# Altium project STANDBY_POWER_SUPPLY_20-100V(Relay).PrjPCB
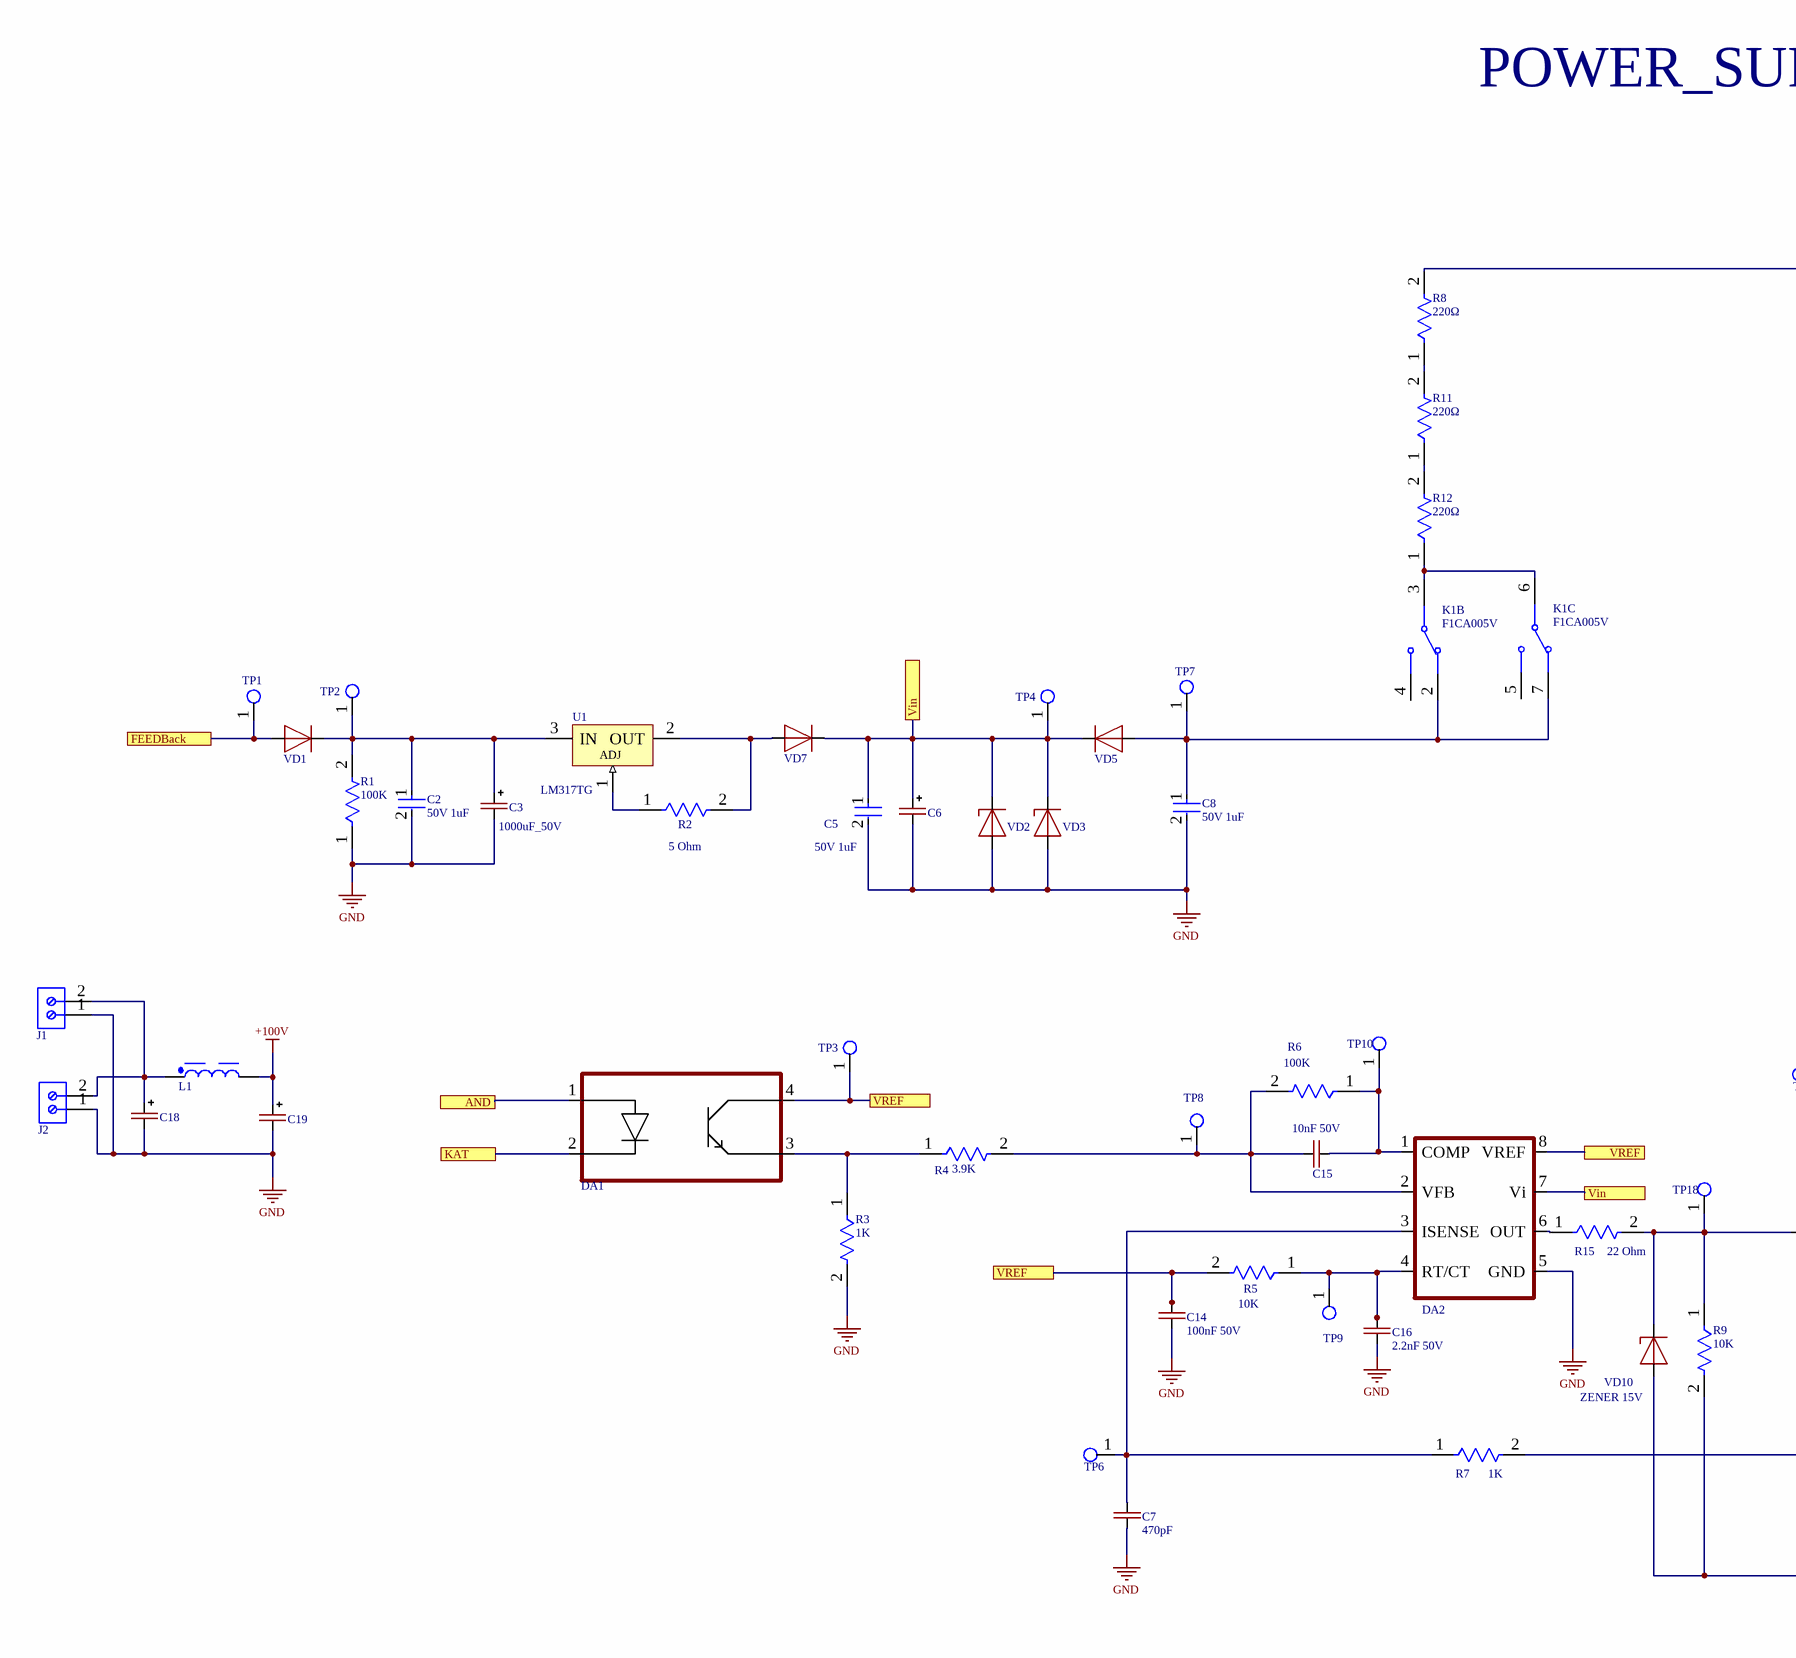
[diagram p0: POWER_SUPPLY_20-100V(Relay).SchDoc, left]
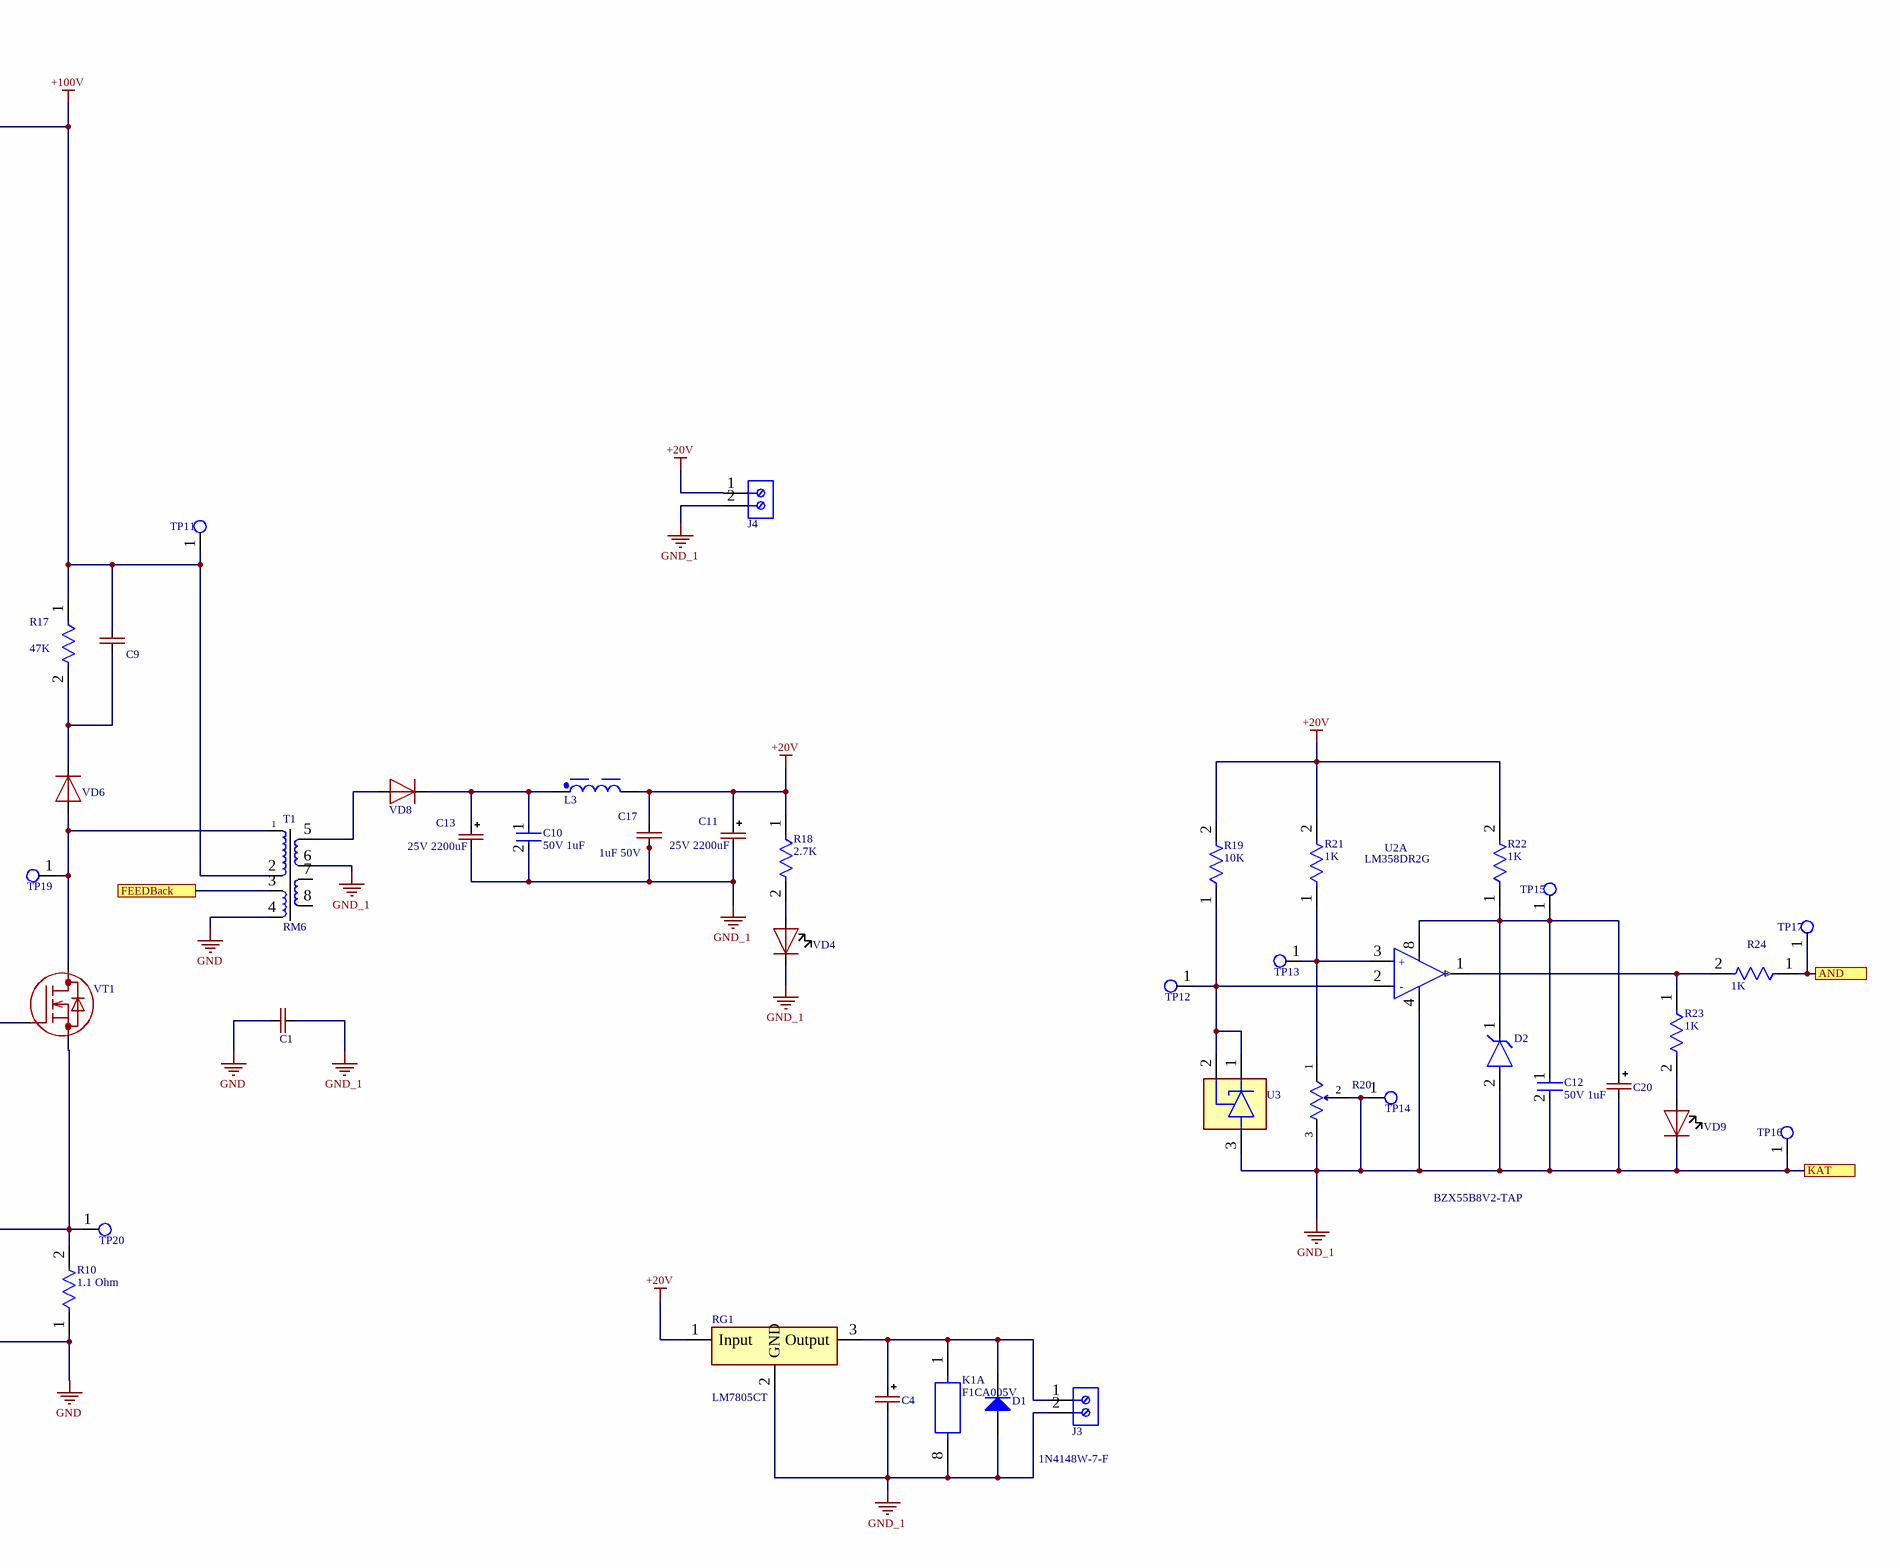
[diagram p1: POWER_SUPPLY_20-100V(Relay).SchDoc, right]
1 sheet, 87 parts. Net scope: flat (ports and power ports of the same name join across sheets).
Board file: POWER_SUPPLY_20-100V(Relay).PcbDoc

## Sheet POWER_SUPPLY_20-100V(Relay).SchDoc
size A1

### Parts
C1  CAP-NON-POLAR  [CAP-V5]  (value not drawn)
C2  50V 1uF  [FP-C0805C-DN-IPC_A]
C3  1000uF_50V  [CAPPOL-12x25]
C4  CAP-POLAR  [CAP-TAN-D]  (value not drawn)
C5  50V 1uF  [FP-C0805C-DN-IPC_A]
C6  CAP-POLAR  [CAPPOL-12x25]  (value not drawn)
C7  470pF  [CAP-0805]
C8  50V 1uF  [FP-C0805C-DN-IPC_A]
C9  CAP-NON-POLAR  [CAP-V5]  (value not drawn)
C10  50V 1uF  [FP-C0805C-DN-IPC_A]
C11  25V 2200uF  [CAPPOL-12x25]
C12  50V 1uF  [FP-C0805C-DN-IPC_A]
C13  25V 2200uF  [CAPPOL-12x25]
C14  100nF 50V  [CAP-0805]
C15  10nF 50V  [CAP-0805]
C16  2.2nF 50V  [CAP-0805]
C17  1uF 50V  [CAP-0805]
C18  CAP-POLAR  [CAPPOL-10x20]  (value not drawn)
C19  CAP-POLAR  [CAPPOL-10x20]  (value not drawn)
C20  CAP-POLAR  [CAP-TAN-D]  (value not drawn)
D1  1N4148W-7-F  [DIOD-SOD123-2_V]
D2  BZX55B8V2-TAP  [FP-SB-V-3906_04-031_4-MFG]
DA1  PC817  [4-SMD]  (value not drawn)
DA2  UC3842B  [SOIC8-150]  (value not drawn)
J1  691101710002  [691101710002]  (value not drawn)
J2  691101710002  [691101710002]  (value not drawn)
J3  691101710002  [691101710002]  (value not drawn)
J4  691101710002  [691101710002]  (value not drawn)
K1  F1CA005V  [V23079-A1001-B301]  (parts A,B,C of 3)
L1  470µH, 0.36A  [WE-PD2_7850]  (value not drawn)
L3  470µH, 0.36A  [WE-PD2_7850]  (value not drawn)
R1  100K  [RES-0805]
R2  5 Ohm  [RES-1206]
R3  1K  [RES-0805]
R4  3.9K  [RES-0805]
R5  10K  [RES-0805]
R6  100K  [RES-0805]
R7  1K  [RES-0805]
R8  220Ω  [RES-2512]
R9  10K  [RES-0805]
R10  1.1 Ohm  [RES-2W]
R11  220Ω  [RES-2512]
R12  220Ω  [RES-2512]
R15  22 Ohm  [RES-0805]
R17  47K  [RES-2512]
R18  2.7K  [RES-0805]
R19  10K  [RES-0805]
R20  3296W-1-202LF  [Bourns_3296W_MFG]  (value not drawn)
R21  1K  [RES-0805]
R22  1K  [RES-0805]
R23  1K  [RES-0805]
R24  1K  [RES-0805]
RG1  LM7805CT  [SOT-223-3]
T1  RM6  [TRANS_RM6]
TP1  Test_Point_PCB  [Test_Point]  (value not drawn)
TP2  Test_Point_PCB  [Test_Point]  (value not drawn)
TP3  Test_Point_PCB  [Test_Point]  (value not drawn)
TP4  Test_Point_PCB  [Test_Point]  (value not drawn)
TP6  Test_Point_PCB  [Test_Point]  (value not drawn)
TP7  Test_Point_PCB  [Test_Point]  (value not drawn)
TP8  Test_Point_PCB  [Test_Point]  (value not drawn)
TP9  Test_Point_PCB  [Test_Point]  (value not drawn)
TP10  Test_Point_PCB  [Test_Point]  (value not drawn)
TP11  Test_Point_PCB  [Test_Point]  (value not drawn)
TP12  Test_Point_PCB  [Test_Point]  (value not drawn)
TP13  Test_Point_PCB  [Test_Point]  (value not drawn)
TP14  Test_Point_PCB  [Test_Point]  (value not drawn)
TP15  Test_Point_PCB  [Test_Point]  (value not drawn)
TP16  Test_Point_PCB  [Test_Point]  (value not drawn)
TP17  Test_Point_PCB  [Test_Point]  (value not drawn)
TP18  Test_Point_PCB  [Test_Point]  (value not drawn)
TP19  Test_Point_PCB  [Test_Point]  (value not drawn)
TP20  Test_Point_PCB  [Test_Point]  (value not drawn)
U1  LM317TG  [TO-220_Bended_Rad]
U2  LM358DR2G  [FP-751-07-IPC_C]  (part A of 2)
U3  TL431  [TL431_SOT-23-3(MGF)]  (value not drawn)
VD1  DIODE  [DO-214AC, SMA]  (value not drawn)
VD2  ZENER  [DO-017AA]  (value not drawn)
VD3  ZENER  [DO-017AA]  (value not drawn)
VD4  LED  [LED-0603]  (value not drawn)
VD5  DIODE  [DO-214AC, SMA]  (value not drawn)
VD6  DIODE  [DO-214AC, SMA]  (value not drawn)
VD7  DIODE  [DO-214AC, SMA]  (value not drawn)
VD8  DIODE  [DO-214AC, SMA]  (value not drawn)
VD9  LED  [LED-0603]  (value not drawn)
VD10  ZENER 15V  [DO-017AA]
VT1  MOSFET-N-GDS  [TO-220_Bended_Rad]  (value not drawn)

### Ports
AND, FEEDBack, KAT, Vin, VREF

### Nets
+20V: C11.1(+) C17.2 J4.1 L3.2 R18.1 R19.2 R21.2 R22.2 RG1.1(Input)
+100V: C9.2 C19.1(+) L1.2 R8.2 R17.1 T1.2 TP11.1(G9)
GND: C1.1 C2.2 C3.2(-) C5.2 C6.2(-) C7.1 C8.2 C14.1 C16.1 C18.2(-) C19.2(-) DA2.5(GND) J1.1 J2.1 R1.1 R3.2 R9.2 R10.1 T1.4 VD2.2(A) VD3.2(A) VD10.2(A)
GND_1: C1.2 C4.2(-) C10.2 C11.2(-) C12.2 C13.2(-) C17.1 C20.2(-) D1.2(A) D2.2(A) DA1.2(CATHODE) J3.2 J4.2 K1.8 R20.2(WIPER) R20.3(CW) RG1.2(GND) T1.6 TP14.1(G9) TP16.1(G9) U2.4(VEE/GND) U3.3(A) VD4.1(C) VD9.1(C) ; port KAT
NetC2_1: C2.1 C3.1(+) R1.2 TP2.1(G9) U1.3(IN) VD1.1(C)
NetC4_1: C4.1(+) D1.1(K) J3.1 K1.1 RG1.3(Output)
NetC5_1: C5.1 C6.1(+) DA2.7(Vi) TP4.1(G9) VD2.1(C) VD3.1(C) VD5.1(C) VD7.1(C) ; port Vin
NetC7_2: C7.2 DA2.3(ISENSE) R7.1 TP6.1(G9)
NetC8_1: C8.1 K1.2 K1.7 TP7.1(G9) VD5.2(A)
NetC9_1: C9.1 R17.2 VD6.1(C)
NetC10_1: C10.1 C13.1(+) L3.1 VD8.1(C)
NetC12_1: C12.1 C20.1(+) D2.1(C) R22.1 TP15.1(G9) U2.8(VCC)
NetC14_2: C14.2 DA1.4(COLLECTOR) DA2.8(VREF) R5.2 TP3.1(G9) ; port VREF
NetC15_1: C15.1 DA2.2(VFB) R4.2 R6.2 TP8.1(G9)
NetC15_2: C15.2 DA2.1(COMP) R6.1 TP10.1(G9)
NetC16_2: C16.2 DA2.4(RT/CT) R5.1 TP9.1(G9)
NetC18_1: C18.1(+) J1.2 J2.2 L1.1
NetDA1_1: DA1.1(ANODE) R24.1 TP17.1(G9) ; port AND
NetDA1_3: DA1.3(EMITTER) R3.1 R4.1
NetDA2_6: DA2.6(OUT) R15.1
NetK1_3: K1.3 K1.6 R12.1
NetR2_1: R2.1 U1.1(ADJ)
NetR2_2: R2.2 U1.2(OUT) VD7.2(A)
NetR7_2: R7.2 R10.2 TP20.1(G9) VT1.3(S)
NetR8_1: R8.1 R11.2
NetR9_1: R9.1 R15.2 TP18.1(G9) VD10.1(C) VT1.1(G)
NetR11_1: R11.1 R12.2
NetR18_2: R18.2 VD4.2(A)
NetR19_1: R19.1 TP12.1(G9) U2.2(INPUT_A-) U3.1(C) U3.2(REF)
NetR20_1: R20.1(CCW) R21.1 TP13.1(G9) U2.3(INPUT_A+)
NetR23_1: R23.1 R24.2 U2.1(OUTPUT_A)
NetR23_2: R23.2 VD9.2(A)
NetT1_1: T1.1 TP19.1(G9) VD6.2(A) VT1.2(D)
NetT1_3: T1.3 TP1.1(G9) VD1.2(A) ; port FEEDBack
NetT1_5: T1.5 VD8.2(A)

Not connected (* = marked no-connect by the designer): K1 4 5; T1 7 8

### Notes on the sheet
- POWER_SUPPLY 20-100V
- (in symbol CMP-1310-00291-2, part A) +; -

### Library data of the parts
C2 C5 C8 C10 C12 = CMP-1036-04552-2: CAP CER 0.22UF 50V X7R 0805; Manufacturer: KEMET; Manufacturer Part Number: C0805C224K5RACTU; Value: 0.22 μF; Temperature Coefficient: 30ppm/°C; Material: Ceramic; Tolerance: 0.1; ComponentLink2URL: https://content.kemet.com/datasheets/KEM_C1003_C0G_SMD.pdf; Temperature Characteristic: X7R; Device Class L3: Ceramic Capacitors; Lead Free: Yes; Temperature: -55°C to +125°C; RoHS: TRUE; Capacitance: 0.22 μF; Automotive: No; Octopart: https://octopart.com/c0805c224k5ractu-kemet-144670; Temperature Range Low: -55°C; Height: 0.88mm; Device Class L1: Passive Components; Digikey Description: CAP CER 0.22UF 50V X7R 0805; ComponentLink2Description: Datasheet; Mouser Description: CAP CER 0.22UF 50V X7R 0805; Category: Cap; Ipc Land Pattern Name: CAPC200125X78; Temperature Range High: +125°C; Package: C0805C-DN; Device Class L2: Capacitors; Voltage Rating: 50 V
C3 = CAP-POLAR: 1000uF_50V  12x25(13x26mm)
C7 C14-C17 = CAP-NON-POLAR
C11 C13 = CAP-POLAR
D1 = 1N4148: Fast Switching Diode, 100 V, 0.15 A, -65 to 150 degC, 2-Pin?SOD123, RoHS, Tape and Reel; Recovery Time: 4ns; Brand: DiodesIncorporated; Unit Weight: 0.000353oz; Max Surge Current: 2A; Peak Reverse Voltage: 100V; Ir - Reverse Current: 1uA; Vf - Forward Voltage: 1.25V; Configuration: Single; If - Forward Current: 0.15A; Product Category: Diodes-GeneralPurpose,Power,Switching; Operating Temperature Range: -65Cto+150C; Packaging: Reel; Manufacturer URL: http://www.diodes.com/; Maximum Operating Temperature: +150C; Height: 1.25mm; Minimum Operating Temperature: -65C; Product: SwitchingDiodes; Package URL: http://www.diodes.com/datasheets/ds18004.pdf; Type: SwitchingDiode; Package Reference: SOD123-2; Width: 1.7mm; Datasheet URL: http://www.farnell.com/datasheets/1915529.pdf; Datasheet Version: Rev. 24-2, 10/2013; Series: 1N4148; Factory Pack Quantity: 3000; Length: 2.85mm; RoHS: True; Manufacturer: DiodesIncorporated; Mounting Style: SMD/SMT; Package / Case: SOD-123
D2 = CMP-02541-000026-1: DIODE ZENER 8.2V 500MW DO35; Test Current: 5mA; Tolerance: 2%; Impedance: 7R; ESD Protection: No; Element Configuration: Single; Max Reverse Leakage Current: 100nA; Packaging: Ammo Pack; Case/Package: DO-35; Lead Free: Lead Free; Number of Pins: 2; Min Operating Temperature: -65°C; Contact Plating: Tin; Max Power Dissipation: 500mW; Radiation Hardening: No; Max Operating Temperature: 175°C; Mount: Through Hole; Package Quantity: 30000; Voltage Tolerance: 2%; Series: Automotive, AEC-Q101; Zener Voltage: 8.2V; RoHS Compliant: Yes; Power Dissipation: 500mW
J1-J4 = 691101710002: WR-TBL Series 101 Horizontal Entry Modular, THT, pitch 5mm, 2p; Manufacturer: Wurth Elektronik; Modularity: Yes; Rated Current: 16A; Working Voltage: 250V; ComponentLink1Description: Website Link; ComponentLink1URL: https://www.we-online.com/redexpert/article/691101710002?ad; ComponentLink2Description: Datasheet Link; ComponentLink2URL: https://www.we-online.com/redexpert/spec/691101710002?ad; Manufacturer Part Number: 691101710002; Category: Terminal Blocks; Match Code: WR-TBL; Mount: Through Hole; Operating Temperature Max: 105°C; Operating Temperature Min: -40°C; Packaging: Box; Application: Pressure Clamp; Number of Pins: 2; Number of Rows: 1; Orientation: Horizontal; Pitch: 5mm
L1 L3 = 744775247: WE-PD2 SMT Power Inductor, size 7850, 470µH, 0.36A, 1.96Ω; Manufacturer: Wurth Elektronik; Case/Size Code: 7850; DC Resistance: 1.37Ω; Saturation Current: 0.38A; Self Resonant Frequency: 3.4MHz; Manufacturer Part Number: 744775247; Category: Unshielded Power Inductors; Match Code: WE-PD2; ComponentLink1Description: Website Link; ComponentLink1URL: https://www.we-online.com/redexpert/article/744775247?ad; ComponentLink2Description: Datasheet Link; ComponentLink2URL: https://www.we-online.com/redexpert/spec/744775247?ad; Mount: Surface Mount; Operating Temperature Max: 125°C; Operating Temperature Min: -40°C; Packaging: Tape and Reel; Length: 7.8mm; Width: 7mm; Height: 4.95mm; DC Resistance Max: 1.96Ω; Inductance: 470µH; Rated Current: 0.36A
R1-R12 R15 R17-R19 R21-R24 = RES-CONST
RG1 = LM7805CT: REG IC REG LINEAR 5V 1A TO220AB; Manufacturer: Fairchild; Voltage Dropout (Max): 2V @ 1A (Typ); Voltage - Input (Max): 35V; helpURL: https://upverter.com/upn/revision/b27a7358b7dd93a3/; ComponentLink2Description: Datasheet; Temperature: -40°C to +125°C; Package: TO220; Supplier 2: Mouser; Price: 0.384521982769; Supplier 1: Digi-Key; ComponentLink1URL: https://upverter.com/upn/revision/b27a7358b7dd93a3/; Supplier Part Number 2: 512-LM7805CT; Supplier Part Number 1: LM7805CT-ND; ComponentLink1Description: Upverter; ComponentLink2URL: https://www.fairchildsemi.com/datasheets/LM/LM7805.pdf; RoHS: TRUE; Mouser Part Number: 512-LM7805CT; Ipc Land Pattern Name: TO-220; Temperature Range High: +125°C; Digikey Description: REG IC REG LINEAR 5V 1A TO220AB; Digikey Part Number: LM7805CT-ND; Lead Free: yes; Temperature Range Low: -40°C; Voltage - Output: 5V; Current-Output: 1A; Part Number: LM7805CT
T1 = Trans_RM6
TP1-TP4 TP6-TP20 = TP_PCB?: Test_Point
U2 = CMP-1310-00291-2: IC OPAMP GP 2 CIRCUIT 8SOIC; Gain Bandwidth Product: 1MHz; Number of Circuits: 2; Min Supply Voltage: 3V; Slew Rate: 0.6V/µs; Max Dual Supply Voltage: 16V; Common Mode Rejection Ratio: 65dB; Input Bias Current: 250nA; Min Dual Supply Voltage: 1.5V; Dual Supply Voltage: 9V; Operating Supply Current: 1.5mA; Output Current: 40mA; Input Offset Voltage (Vos): 7mV; Nominal Supply Current: 1.2mA; Voltage Gain: 100dB; Max Supply Voltage: 32V; Width: 4mm; Number of Pins: 8; Min Operating Temperature: 0°C; REACH SVHC: No SVHC; Contact Plating: Tin; Lead Free: Lead Free; Halogen Free: Halogen Free; Power Supply Rejection Ratio (PSRR): 65dB; Operating Supply Voltage: 16V; Package Quantity: 2500; Max Operating Temperature: 70°C; Case/Package: SOIC; Height: 1.5mm; Packaging: Tape and Reel; Radiation Hardening: No; Number of Channels: 2; Bandwidth: 1MHz; Length: 5mm; Number of Elements: 2; Number of Amplifiers: 2; Output Current per Channel: 40mA
U3 = TL431_SOT-23-3
VD10 = ZENER